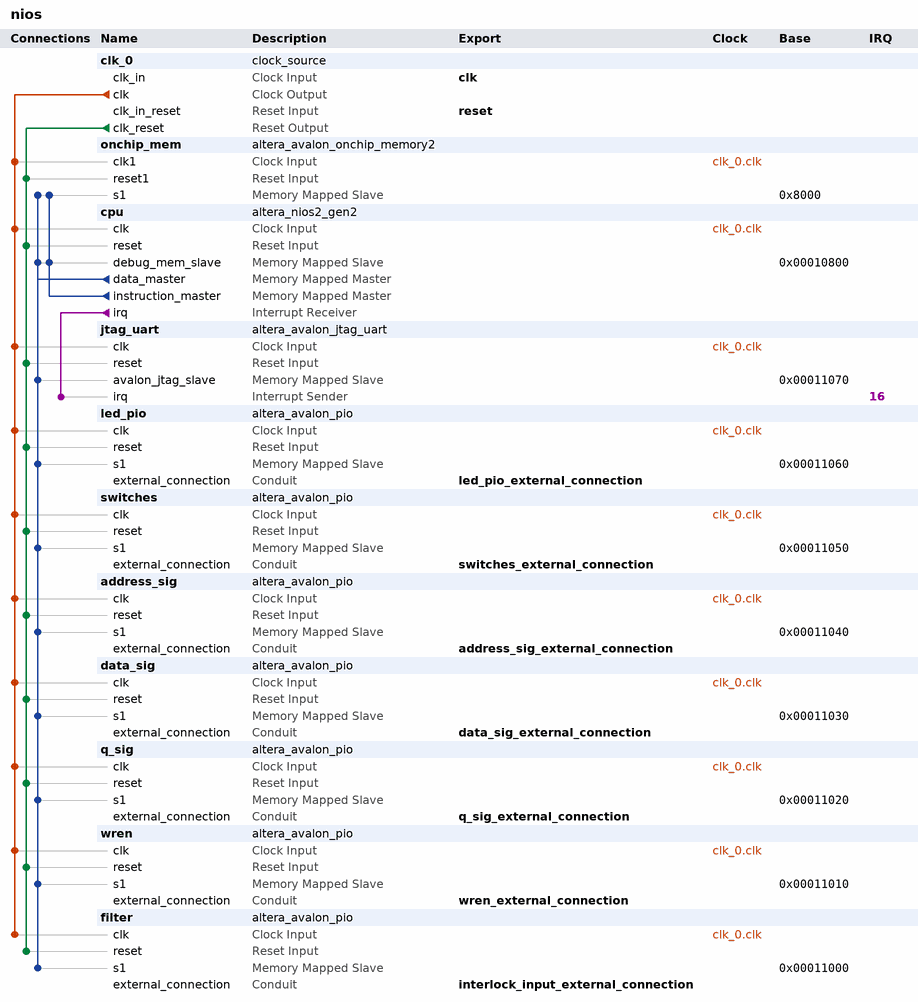
[diagram p0: system contents]
# Platform Designer (Qsys) system nios, Cyclone V 5CSEMA5F31C6
# Parameters at their usual value, and those the tool derives, are not listed.
package require -exact qsys 17.1
create_system nios
set_project_property DEVICE_FAMILY {Cyclone V}
set_project_property DEVICE 5CSEMA5F31C6

add_instance clk_0 clock_source 17.1
set_instance_parameter_value clk_0 clockFrequency 50000000

add_instance onchip_mem altera_avalon_onchip_memory2 17.1
set_instance_parameter_value onchip_mem dataWidth 32
set_instance_parameter_value onchip_mem dualPort false
set_instance_parameter_value onchip_mem initMemContent true
set_instance_parameter_value onchip_mem initializationFileName onchip_mem.hex
set_instance_parameter_value onchip_mem memorySize 20480

add_instance cpu altera_nios2_gen2 17.1
set_instance_parameter_value cpu dcache_size 2048
set_instance_parameter_value cpu exceptionSlave onchip_mem.s1
set_instance_parameter_value cpu icache_size 4096
set_instance_parameter_value cpu impl Tiny
set_instance_parameter_value cpu resetSlave onchip_mem.s1
set_instance_parameter_value cpu setting_activateTrace true

add_instance jtag_uart altera_avalon_jtag_uart 17.1
set_instance_parameter_value jtag_uart simInteractiveOptions NO_INTERACTIVE_WINDOWS

add_instance led_pio altera_avalon_pio 17.1
set_instance_parameter_value led_pio direction Output
set_instance_parameter_value led_pio width 8

add_instance switches altera_avalon_pio 17.1
set_instance_parameter_value switches direction Input
set_instance_parameter_value switches width 8

add_instance address_sig altera_avalon_pio 17.1
set_instance_parameter_value address_sig direction Output
set_instance_parameter_value address_sig width 8

add_instance data_sig altera_avalon_pio 17.1
set_instance_parameter_value data_sig direction Output
set_instance_parameter_value data_sig width 16

add_instance q_sig altera_avalon_pio 17.1
set_instance_parameter_value q_sig direction Input
set_instance_parameter_value q_sig width 16

add_instance wren altera_avalon_pio 17.1
set_instance_parameter_value wren direction Output
set_instance_parameter_value wren width 1

add_instance filter altera_avalon_pio 17.1
set_instance_parameter_value filter direction Output
set_instance_parameter_value filter width 8

# connections
add_connection clk_0.clk address_sig.clk clock
add_connection clk_0.clk cpu.clk clock
add_connection clk_0.clk data_sig.clk clock
add_connection clk_0.clk filter.clk clock
add_connection clk_0.clk jtag_uart.clk clock
add_connection clk_0.clk led_pio.clk clock
add_connection clk_0.clk onchip_mem.clk1 clock
add_connection clk_0.clk q_sig.clk clock
add_connection clk_0.clk switches.clk clock
add_connection clk_0.clk wren.clk clock
add_connection clk_0.clk_reset address_sig.reset reset
add_connection clk_0.clk_reset cpu.reset reset
add_connection clk_0.clk_reset data_sig.reset reset
add_connection clk_0.clk_reset filter.reset reset
add_connection clk_0.clk_reset jtag_uart.reset reset
add_connection clk_0.clk_reset led_pio.reset reset
add_connection clk_0.clk_reset onchip_mem.reset1 reset
add_connection clk_0.clk_reset q_sig.reset reset
add_connection clk_0.clk_reset switches.reset reset
add_connection clk_0.clk_reset wren.reset reset
add_connection cpu.data_master address_sig.s1 avalon
set_connection_parameter_value cpu.data_master/address_sig.s1 baseAddress 0x00011040
add_connection cpu.data_master cpu.debug_mem_slave avalon
set_connection_parameter_value cpu.data_master/cpu.debug_mem_slave baseAddress 0x00010800
add_connection cpu.data_master data_sig.s1 avalon
set_connection_parameter_value cpu.data_master/data_sig.s1 baseAddress 0x00011030
add_connection cpu.data_master filter.s1 avalon
set_connection_parameter_value cpu.data_master/filter.s1 baseAddress 0x00011000
add_connection cpu.data_master jtag_uart.avalon_jtag_slave avalon
set_connection_parameter_value cpu.data_master/jtag_uart.avalon_jtag_slave baseAddress 0x00011070
add_connection cpu.data_master led_pio.s1 avalon
set_connection_parameter_value cpu.data_master/led_pio.s1 baseAddress 0x00011060
add_connection cpu.data_master onchip_mem.s1 avalon
set_connection_parameter_value cpu.data_master/onchip_mem.s1 baseAddress 0x8000
add_connection cpu.data_master q_sig.s1 avalon
set_connection_parameter_value cpu.data_master/q_sig.s1 baseAddress 0x00011020
add_connection cpu.data_master switches.s1 avalon
set_connection_parameter_value cpu.data_master/switches.s1 baseAddress 0x00011050
add_connection cpu.data_master wren.s1 avalon
set_connection_parameter_value cpu.data_master/wren.s1 baseAddress 0x00011010
add_connection cpu.instruction_master cpu.debug_mem_slave avalon
set_connection_parameter_value cpu.instruction_master/cpu.debug_mem_slave baseAddress 0x00010800
add_connection cpu.instruction_master onchip_mem.s1 avalon
set_connection_parameter_value cpu.instruction_master/onchip_mem.s1 baseAddress 0x8000
add_connection cpu.irq jtag_uart.irq interrupt
set_connection_parameter_value cpu.irq/jtag_uart.irq irqNumber 16

# exported interfaces
add_interface address_sig_external_connection conduit end
set_interface_property address_sig_external_connection EXPORT_OF address_sig.external_connection
add_interface clk clock sink
set_interface_property clk EXPORT_OF clk_0.clk_in
add_interface data_sig_external_connection conduit end
set_interface_property data_sig_external_connection EXPORT_OF data_sig.external_connection
add_interface interlock_input_external_connection conduit end
set_interface_property interlock_input_external_connection EXPORT_OF filter.external_connection
add_interface led_pio_external_connection conduit end
set_interface_property led_pio_external_connection EXPORT_OF led_pio.external_connection
add_interface q_sig_external_connection conduit end
set_interface_property q_sig_external_connection EXPORT_OF q_sig.external_connection
add_interface reset reset sink
set_interface_property reset EXPORT_OF clk_0.clk_in_reset
add_interface switches_external_connection conduit end
set_interface_property switches_external_connection EXPORT_OF switches.external_connection
add_interface wren_external_connection conduit end
set_interface_property wren_external_connection EXPORT_OF wren.external_connection

set_interconnect_requirement {$system} qsys_mm.clockCrossingAdapter HANDSHAKE
set_interconnect_requirement {$system} qsys_mm.enableEccProtection FALSE
set_interconnect_requirement {$system} qsys_mm.insertDefaultSlave FALSE
set_interconnect_requirement {$system} qsys_mm.maxAdditionalLatency 1

save_system nios.qsys
